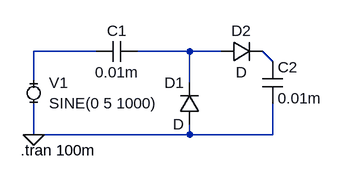
[diagram p0: schematic Draft3.asc]
Draft3.asc, the LTspice schematic file:
Version 4
SHEET 1 880 680
WIRE 128 112 32 112
WIRE 272 112 192 112
WIRE 320 112 272 112
WIRE 400 128 384 112
WIRE 32 160 32 112
WIRE 272 160 272 112
WIRE 32 240 32 192
WIRE 272 240 272 224
WIRE 272 240 32 240
WIRE 400 240 400 192
WIRE 400 240 272 240
FLAG 32 240 0
SYMBOL MiniSyms4\\voltage- 32 176 R0
WINDOW 123 0 0 Left 2
WINDOW 39 0 0 Left 2
SYMATTR InstName V1
SYMATTR Value SINE(0 5 1000)
SYMBOL cap 192 96 R90
WINDOW 0 0 32 VBottom 2
WINDOW 3 32 32 VTop 2
SYMATTR InstName C1
SYMATTR Value 0.01m
SYMBOL diode 288 224 R180
WINDOW 0 24 64 Left 2
WINDOW 3 24 0 Left 2
SYMATTR InstName D1
SYMBOL diode 320 128 R270
WINDOW 0 32 32 VTop 2
WINDOW 3 0 32 VBottom 2
SYMATTR InstName D2
SYMBOL cap 384 128 R0
SYMATTR InstName C2
SYMATTR Value 0.01m
TEXT 12 264 Left 2 !.tran 100m

The netlist it stands for:
* Draft3.asc
V1 N001 0 SINE(0 5 1000)
C1 N002 N001 0.01m
D1 0 N002 D
D2 N002 N003 D
C2 N003 0 0.01m
.model D D
.lib standard.dio
.tran 100m
.backanno
.end